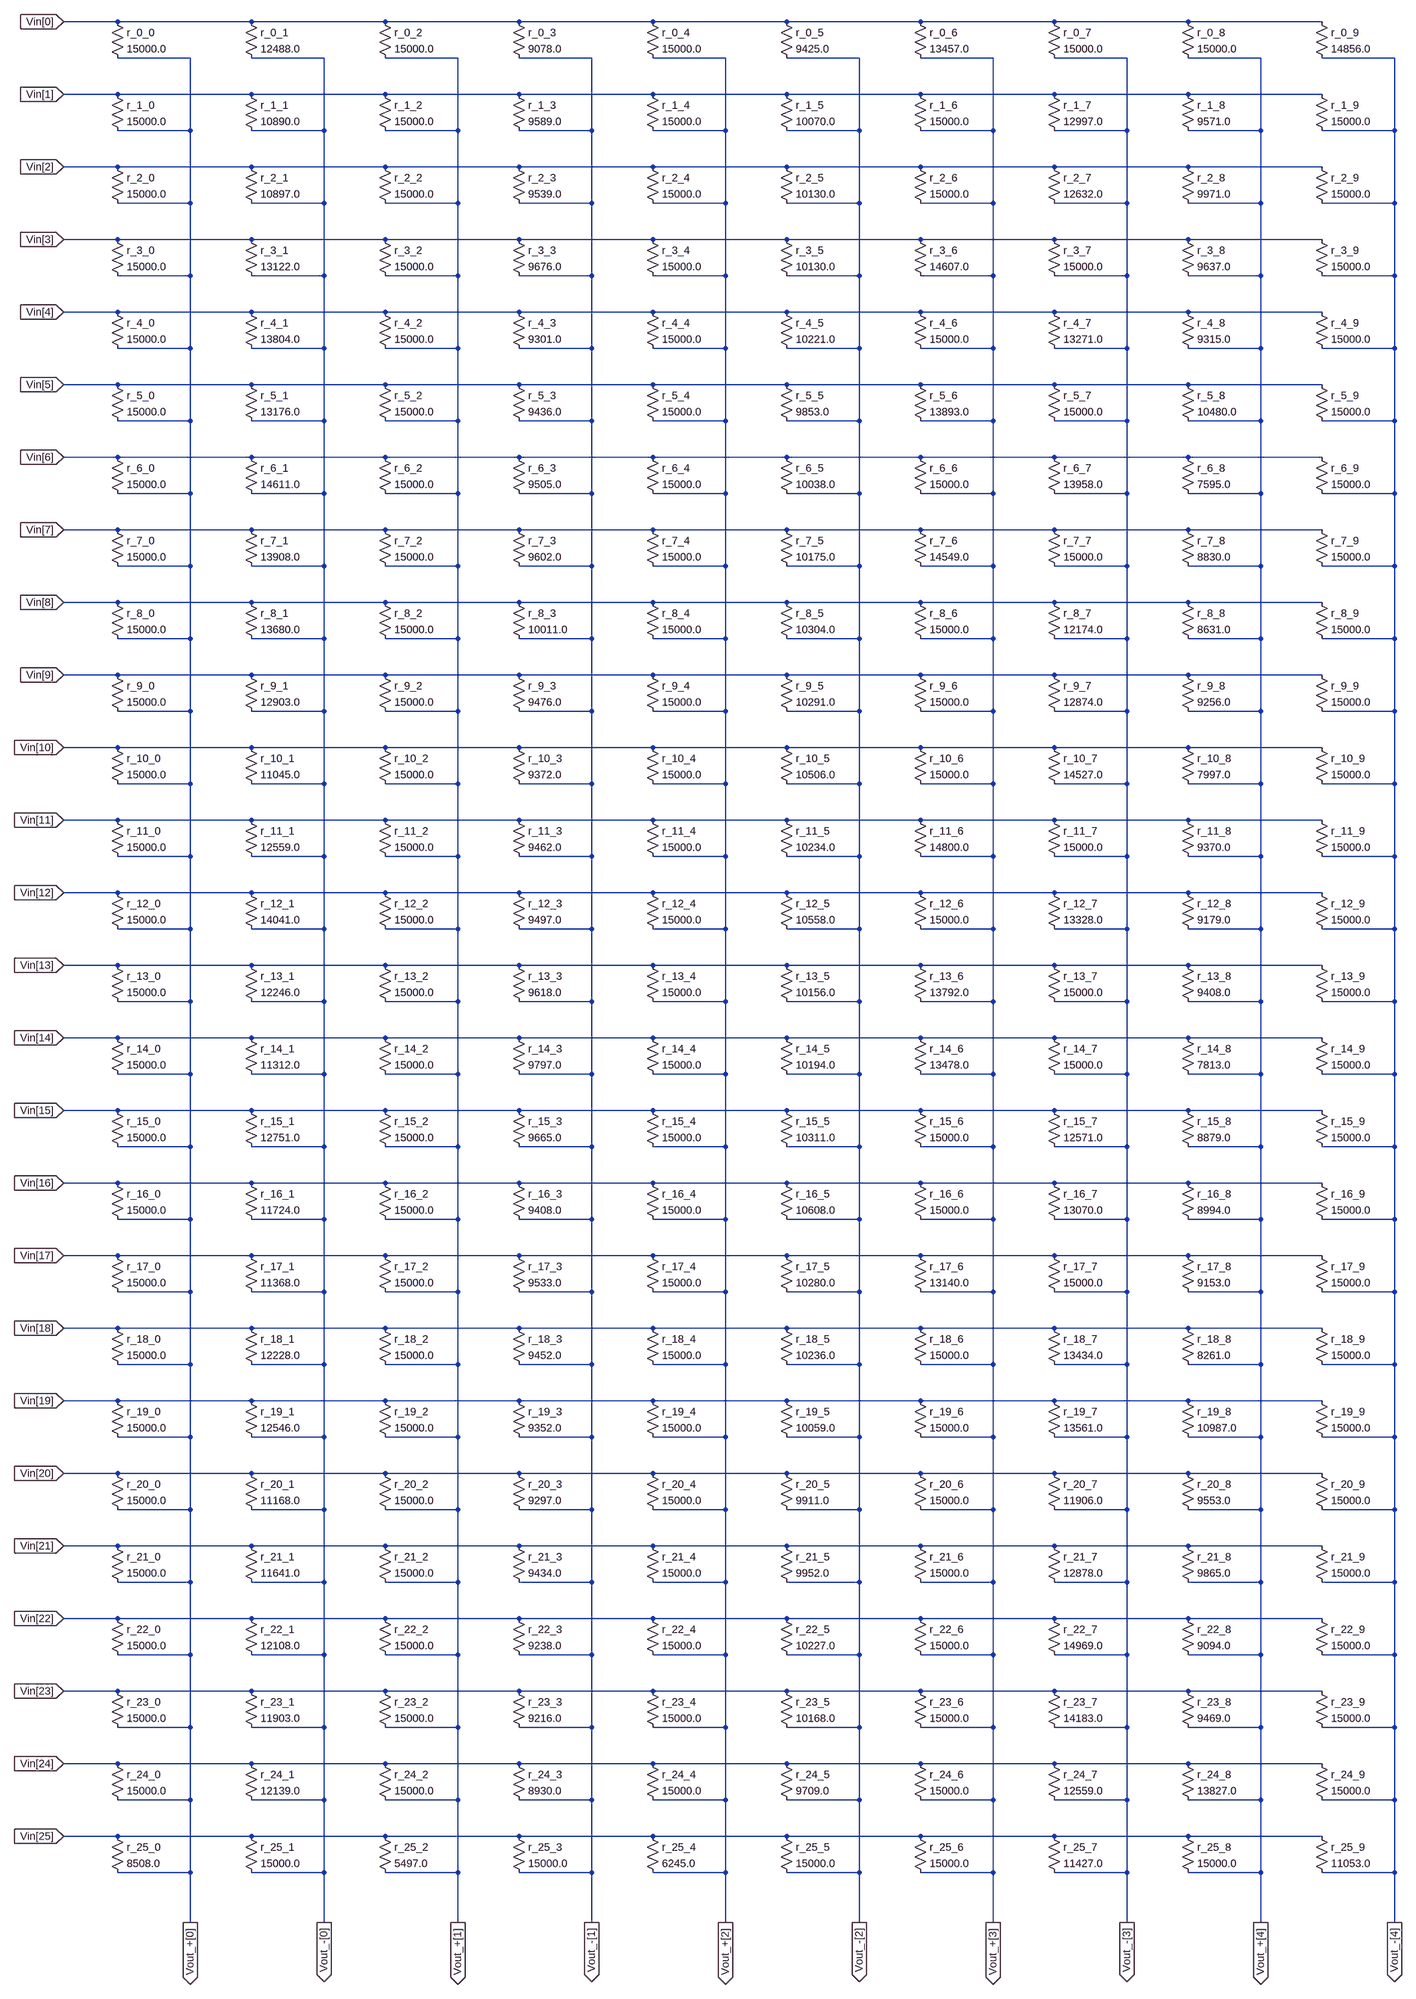
[diagram p0: schematic X_cbar_26by10.asc]
X_cbar_26by10.asc, the LTspice schematic file:
Version 4 
SHEET 1 2360 680
WIRE -160 16 4176 16
WIRE -160 176 4176 176
WIRE -160 336 4176 336
WIRE -160 496 4176 496
WIRE -160 656 4176 656
WIRE -160 816 4176 816
WIRE -160 976 4176 976
WIRE -160 1136 4176 1136
WIRE -160 1296 4176 1296
WIRE -160 1456 4176 1456
WIRE -160 1616 4176 1616
WIRE -160 1776 4176 1776
WIRE -160 1936 4176 1936
WIRE -160 2096 4176 2096
WIRE -160 2256 4176 2256
WIRE -160 2416 4176 2416
WIRE -160 2576 4176 2576
WIRE -160 2736 4176 2736
WIRE -160 2896 4176 2896
WIRE -160 3056 4176 3056
WIRE -160 3216 4176 3216
WIRE -160 3376 4176 3376
WIRE -160 3536 4176 3536
WIRE -160 3696 4176 3696
WIRE -160 3856 4176 3856
WIRE -160 4016 4176 4016
WIRE 16 96 176 96
WIRE 176 96 176 256
WIRE 336 96 496 96
WIRE 496 96 496 256
WIRE 976 96 1136 96
WIRE 1136 96 1136 256
WIRE 1296 96 1456 96
WIRE 1456 96 1456 256
WIRE 1936 96 2096 96
WIRE 2096 96 2096 256
WIRE 2256 96 2416 96
WIRE 2416 96 2416 256
WIRE 2896 96 3056 96
WIRE 3056 96 3056 256
WIRE 3216 96 3376 96
WIRE 3376 96 3376 256
WIRE 3856 96 4016 96
WIRE 4016 96 4016 256
WIRE 4176 96 4336 96
WIRE 4336 96 4336 256
WIRE 16 256 176 256
WIRE 176 256 176 416
WIRE 336 256 496 256
WIRE 496 256 496 416
WIRE 976 256 1136 256
WIRE 1136 256 1136 416
WIRE 1296 256 1456 256
WIRE 1456 256 1456 416
WIRE 1936 256 2096 256
WIRE 2096 256 2096 416
WIRE 2256 256 2416 256
WIRE 2416 256 2416 416
WIRE 2896 256 3056 256
WIRE 3056 256 3056 416
WIRE 3216 256 3376 256
WIRE 3376 256 3376 416
WIRE 3856 256 4016 256
WIRE 4016 256 4016 416
WIRE 4176 256 4336 256
WIRE 4336 256 4336 416
WIRE 16 416 176 416
WIRE 176 416 176 576
WIRE 336 416 496 416
WIRE 496 416 496 576
WIRE 976 416 1136 416
WIRE 1136 416 1136 576
WIRE 1296 416 1456 416
WIRE 1456 416 1456 576
WIRE 1936 416 2096 416
WIRE 2096 416 2096 576
WIRE 2256 416 2416 416
WIRE 2416 416 2416 576
WIRE 2896 416 3056 416
WIRE 3056 416 3056 576
WIRE 3216 416 3376 416
WIRE 3376 416 3376 576
WIRE 3856 416 4016 416
WIRE 4016 416 4016 576
WIRE 4176 416 4336 416
WIRE 4336 416 4336 576
WIRE 16 576 176 576
WIRE 176 576 176 736
WIRE 336 576 496 576
WIRE 496 576 496 736
WIRE 976 576 1136 576
WIRE 1136 576 1136 736
WIRE 1296 576 1456 576
WIRE 1456 576 1456 736
WIRE 1936 576 2096 576
WIRE 2096 576 2096 736
WIRE 2256 576 2416 576
WIRE 2416 576 2416 736
WIRE 2896 576 3056 576
WIRE 3056 576 3056 736
WIRE 3216 576 3376 576
WIRE 3376 576 3376 736
WIRE 3856 576 4016 576
WIRE 4016 576 4016 736
WIRE 4176 576 4336 576
WIRE 4336 576 4336 736
WIRE 16 736 176 736
WIRE 176 736 176 896
WIRE 336 736 496 736
WIRE 496 736 496 896
WIRE 976 736 1136 736
WIRE 1136 736 1136 896
WIRE 1296 736 1456 736
WIRE 1456 736 1456 896
WIRE 1936 736 2096 736
WIRE 2096 736 2096 896
WIRE 2256 736 2416 736
WIRE 2416 736 2416 896
WIRE 2896 736 3056 736
WIRE 3056 736 3056 896
WIRE 3216 736 3376 736
WIRE 3376 736 3376 896
WIRE 3856 736 4016 736
WIRE 4016 736 4016 896
WIRE 4176 736 4336 736
WIRE 4336 736 4336 896
WIRE 16 896 176 896
WIRE 176 896 176 1056
WIRE 336 896 496 896
WIRE 496 896 496 1056
WIRE 976 896 1136 896
WIRE 1136 896 1136 1056
WIRE 1296 896 1456 896
WIRE 1456 896 1456 1056
WIRE 1936 896 2096 896
WIRE 2096 896 2096 1056
WIRE 2256 896 2416 896
WIRE 2416 896 2416 1056
WIRE 2896 896 3056 896
WIRE 3056 896 3056 1056
WIRE 3216 896 3376 896
WIRE 3376 896 3376 1056
WIRE 3856 896 4016 896
WIRE 4016 896 4016 1056
WIRE 4176 896 4336 896
WIRE 4336 896 4336 1056
WIRE 16 1056 176 1056
WIRE 176 1056 176 1216
WIRE 336 1056 496 1056
WIRE 496 1056 496 1216
WIRE 976 1056 1136 1056
WIRE 1136 1056 1136 1216
WIRE 1296 1056 1456 1056
WIRE 1456 1056 1456 1216
WIRE 1936 1056 2096 1056
WIRE 2096 1056 2096 1216
WIRE 2256 1056 2416 1056
WIRE 2416 1056 2416 1216
WIRE 2896 1056 3056 1056
WIRE 3056 1056 3056 1216
WIRE 3216 1056 3376 1056
WIRE 3376 1056 3376 1216
WIRE 3856 1056 4016 1056
WIRE 4016 1056 4016 1216
WIRE 4176 1056 4336 1056
WIRE 4336 1056 4336 1216
WIRE 16 1216 176 1216
WIRE 176 1216 176 1376
WIRE 336 1216 496 1216
WIRE 496 1216 496 1376
WIRE 976 1216 1136 1216
WIRE 1136 1216 1136 1376
WIRE 1296 1216 1456 1216
WIRE 1456 1216 1456 1376
WIRE 1936 1216 2096 1216
WIRE 2096 1216 2096 1376
WIRE 2256 1216 2416 1216
WIRE 2416 1216 2416 1376
WIRE 2896 1216 3056 1216
WIRE 3056 1216 3056 1376
WIRE 3216 1216 3376 1216
WIRE 3376 1216 3376 1376
WIRE 3856 1216 4016 1216
WIRE 4016 1216 4016 1376
WIRE 4176 1216 4336 1216
WIRE 4336 1216 4336 1376
WIRE 16 1376 176 1376
WIRE 176 1376 176 1536
WIRE 336 1376 496 1376
WIRE 496 1376 496 1536
WIRE 976 1376 1136 1376
WIRE 1136 1376 1136 1536
WIRE 1296 1376 1456 1376
WIRE 1456 1376 1456 1536
WIRE 1936 1376 2096 1376
WIRE 2096 1376 2096 1536
WIRE 2256 1376 2416 1376
WIRE 2416 1376 2416 1536
WIRE 2896 1376 3056 1376
WIRE 3056 1376 3056 1536
WIRE 3216 1376 3376 1376
WIRE 3376 1376 3376 1536
WIRE 3856 1376 4016 1376
WIRE 4016 1376 4016 1536
WIRE 4176 1376 4336 1376
WIRE 4336 1376 4336 1536
WIRE 16 1536 176 1536
WIRE 176 1536 176 1696
WIRE 336 1536 496 1536
WIRE 496 1536 496 1696
WIRE 976 1536 1136 1536
WIRE 1136 1536 1136 1696
WIRE 1296 1536 1456 1536
WIRE 1456 1536 1456 1696
WIRE 1936 1536 2096 1536
WIRE 2096 1536 2096 1696
WIRE 2256 1536 2416 1536
WIRE 2416 1536 2416 1696
WIRE 2896 1536 3056 1536
WIRE 3056 1536 3056 1696
WIRE 3216 1536 3376 1536
WIRE 3376 1536 3376 1696
WIRE 3856 1536 4016 1536
WIRE 4016 1536 4016 1696
WIRE 4176 1536 4336 1536
WIRE 4336 1536 4336 1696
WIRE 16 1696 176 1696
WIRE 176 1696 176 1856
WIRE 336 1696 496 1696
WIRE 496 1696 496 1856
WIRE 976 1696 1136 1696
WIRE 1136 1696 1136 1856
WIRE 1296 1696 1456 1696
WIRE 1456 1696 1456 1856
WIRE 1936 1696 2096 1696
WIRE 2096 1696 2096 1856
WIRE 2256 1696 2416 1696
WIRE 2416 1696 2416 1856
WIRE 2896 1696 3056 1696
WIRE 3056 1696 3056 1856
WIRE 3216 1696 3376 1696
WIRE 3376 1696 3376 1856
WIRE 3856 1696 4016 1696
WIRE 4016 1696 4016 1856
WIRE 4176 1696 4336 1696
WIRE 4336 1696 4336 1856
WIRE 16 1856 176 1856
WIRE 176 1856 176 2016
WIRE 336 1856 496 1856
WIRE 496 1856 496 2016
WIRE 976 1856 1136 1856
WIRE 1136 1856 1136 2016
WIRE 1296 1856 1456 1856
WIRE 1456 1856 1456 2016
WIRE 1936 1856 2096 1856
WIRE 2096 1856 2096 2016
WIRE 2256 1856 2416 1856
WIRE 2416 1856 2416 2016
WIRE 2896 1856 3056 1856
WIRE 3056 1856 3056 2016
WIRE 3216 1856 3376 1856
WIRE 3376 1856 3376 2016
WIRE 3856 1856 4016 1856
WIRE 4016 1856 4016 2016
WIRE 4176 1856 4336 1856
WIRE 4336 1856 4336 2016
WIRE 16 2016 176 2016
WIRE 176 2016 176 2176
WIRE 336 2016 496 2016
WIRE 496 2016 496 2176
WIRE 976 2016 1136 2016
WIRE 1136 2016 1136 2176
WIRE 1296 2016 1456 2016
WIRE 1456 2016 1456 2176
WIRE 1936 2016 2096 2016
WIRE 2096 2016 2096 2176
WIRE 2256 2016 2416 2016
WIRE 2416 2016 2416 2176
WIRE 2896 2016 3056 2016
WIRE 3056 2016 3056 2176
WIRE 3216 2016 3376 2016
WIRE 3376 2016 3376 2176
WIRE 3856 2016 4016 2016
WIRE 4016 2016 4016 2176
WIRE 4176 2016 4336 2016
WIRE 4336 2016 4336 2176
WIRE 16 2176 176 2176
WIRE 176 2176 176 2336
WIRE 336 2176 496 2176
WIRE 496 2176 496 2336
WIRE 976 2176 1136 2176
WIRE 1136 2176 1136 2336
WIRE 1296 2176 1456 2176
WIRE 1456 2176 1456 2336
WIRE 1936 2176 2096 2176
WIRE 2096 2176 2096 2336
WIRE 2256 2176 2416 2176
WIRE 2416 2176 2416 2336
WIRE 2896 2176 3056 2176
WIRE 3056 2176 3056 2336
WIRE 3216 2176 3376 2176
WIRE 3376 2176 3376 2336
WIRE 3856 2176 4016 2176
WIRE 4016 2176 4016 2336
WIRE 4176 2176 4336 2176
WIRE 4336 2176 4336 2336
WIRE 16 2336 176 2336
WIRE 176 2336 176 2496
WIRE 336 2336 496 2336
WIRE 496 2336 496 2496
WIRE 976 2336 1136 2336
WIRE 1136 2336 1136 2496
WIRE 1296 2336 1456 2336
WIRE 1456 2336 1456 2496
WIRE 1936 2336 2096 2336
WIRE 2096 2336 2096 2496
WIRE 2256 2336 2416 2336
WIRE 2416 2336 2416 2496
WIRE 2896 2336 3056 2336
WIRE 3056 2336 3056 2496
WIRE 3216 2336 3376 2336
WIRE 3376 2336 3376 2496
WIRE 3856 2336 4016 2336
WIRE 4016 2336 4016 2496
WIRE 4176 2336 4336 2336
WIRE 4336 2336 4336 2496
WIRE 16 2496 176 2496
WIRE 176 2496 176 2656
WIRE 336 2496 496 2496
WIRE 496 2496 496 2656
WIRE 976 2496 1136 2496
WIRE 1136 2496 1136 2656
WIRE 1296 2496 1456 2496
WIRE 1456 2496 1456 2656
WIRE 1936 2496 2096 2496
WIRE 2096 2496 2096 2656
WIRE 2256 2496 2416 2496
WIRE 2416 2496 2416 2656
WIRE 2896 2496 3056 2496
WIRE 3056 2496 3056 2656
WIRE 3216 2496 3376 2496
WIRE 3376 2496 3376 2656
WIRE 3856 2496 4016 2496
WIRE 4016 2496 4016 2656
WIRE 4176 2496 4336 2496
WIRE 4336 2496 4336 2656
WIRE 16 2656 176 2656
WIRE 176 2656 176 2816
WIRE 336 2656 496 2656
WIRE 496 2656 496 2816
WIRE 976 2656 1136 2656
WIRE 1136 2656 1136 2816
WIRE 1296 2656 1456 2656
WIRE 1456 2656 1456 2816
WIRE 1936 2656 2096 2656
WIRE 2096 2656 2096 2816
WIRE 2256 2656 2416 2656
WIRE 2416 2656 2416 2816
WIRE 2896 2656 3056 2656
WIRE 3056 2656 3056 2816
WIRE 3216 2656 3376 2656
WIRE 3376 2656 3376 2816
WIRE 3856 2656 4016 2656
WIRE 4016 2656 4016 2816
WIRE 4176 2656 4336 2656
WIRE 4336 2656 4336 2816
WIRE 16 2816 176 2816
WIRE 176 2816 176 2976
WIRE 336 2816 496 2816
WIRE 496 2816 496 2976
WIRE 976 2816 1136 2816
WIRE 1136 2816 1136 2976
WIRE 1296 2816 1456 2816
WIRE 1456 2816 1456 2976
WIRE 1936 2816 2096 2816
WIRE 2096 2816 2096 2976
WIRE 2256 2816 2416 2816
WIRE 2416 2816 2416 2976
WIRE 2896 2816 3056 2816
WIRE 3056 2816 3056 2976
WIRE 3216 2816 3376 2816
WIRE 3376 2816 3376 2976
WIRE 3856 2816 4016 2816
WIRE 4016 2816 4016 2976
WIRE 4176 2816 4336 2816
WIRE 4336 2816 4336 2976
WIRE 16 2976 176 2976
WIRE 176 2976 176 3136
WIRE 336 2976 496 2976
WIRE 496 2976 496 3136
WIRE 976 2976 1136 2976
WIRE 1136 2976 1136 3136
WIRE 1296 2976 1456 2976
WIRE 1456 2976 1456 3136
WIRE 1936 2976 2096 2976
WIRE 2096 2976 2096 3136
WIRE 2256 2976 2416 2976
WIRE 2416 2976 2416 3136
WIRE 2896 2976 3056 2976
WIRE 3056 2976 3056 3136
WIRE 3216 2976 3376 2976
WIRE 3376 2976 3376 3136
WIRE 3856 2976 4016 2976
WIRE 4016 2976 4016 3136
WIRE 4176 2976 4336 2976
WIRE 4336 2976 4336 3136
WIRE 16 3136 176 3136
WIRE 176 3136 176 3296
WIRE 336 3136 496 3136
WIRE 496 3136 496 3296
WIRE 976 3136 1136 3136
WIRE 1136 3136 1136 3296
WIRE 1296 3136 1456 3136
WIRE 1456 3136 1456 3296
WIRE 1936 3136 2096 3136
WIRE 2096 3136 2096 3296
WIRE 2256 3136 2416 3136
WIRE 2416 3136 2416 3296
WIRE 2896 3136 3056 3136
WIRE 3056 3136 3056 3296
WIRE 3216 3136 3376 3136
WIRE 3376 3136 3376 3296
WIRE 3856 3136 4016 3136
WIRE 4016 3136 4016 3296
WIRE 4176 3136 4336 3136
WIRE 4336 3136 4336 3296
WIRE 16 3296 176 3296
WIRE 176 3296 176 3456
WIRE 336 3296 496 3296
WIRE 496 3296 496 3456
WIRE 976 3296 1136 3296
WIRE 1136 3296 1136 3456
WIRE 1296 3296 1456 3296
WIRE 1456 3296 1456 3456
WIRE 1936 3296 2096 3296
WIRE 2096 3296 2096 3456
WIRE 2256 3296 2416 3296
WIRE 2416 3296 2416 3456
WIRE 2896 3296 3056 3296
WIRE 3056 3296 3056 3456
WIRE 3216 3296 3376 3296
WIRE 3376 3296 3376 3456
WIRE 3856 3296 4016 3296
WIRE 4016 3296 4016 3456
WIRE 4176 3296 4336 3296
WIRE 4336 3296 4336 3456
WIRE 16 3456 176 3456
WIRE 176 3456 176 3616
WIRE 336 3456 496 3456
WIRE 496 3456 496 3616
WIRE 976 3456 1136 3456
WIRE 1136 3456 1136 3616
WIRE 1296 3456 1456 3456
WIRE 1456 3456 1456 3616
WIRE 1936 3456 2096 3456
WIRE 2096 3456 2096 3616
WIRE 2256 3456 2416 3456
WIRE 2416 3456 2416 3616
WIRE 2896 3456 3056 3456
WIRE 3056 3456 3056 3616
WIRE 3216 3456 3376 3456
WIRE 3376 3456 3376 3616
WIRE 3856 3456 4016 3456
WIRE 4016 3456 4016 3616
WIRE 4176 3456 4336 3456
WIRE 4336 3456 4336 3616
WIRE 16 3616 176 3616
WIRE 176 3616 176 3776
WIRE 336 3616 496 3616
WIRE 496 3616 496 3776
WIRE 976 3616 1136 3616
WIRE 1136 3616 1136 3776
WIRE 1296 3616 1456 3616
WIRE 1456 3616 1456 3776
WIRE 1936 3616 2096 3616
WIRE 2096 3616 2096 3776
WIRE 2256 3616 2416 3616
WIRE 2416 3616 2416 3776
WIRE 2896 3616 3056 3616
WIRE 3056 3616 3056 3776
WIRE 3216 3616 3376 3616
WIRE 3376 3616 3376 3776
WIRE 3856 3616 4016 3616
WIRE 4016 3616 4016 3776
WIRE 4176 3616 4336 3616
WIRE 4336 3616 4336 3776
WIRE 16 3776 176 3776
WIRE 176 3776 176 3936
WIRE 336 3776 496 3776
WIRE 496 3776 496 3936
WIRE 976 3776 1136 3776
WIRE 1136 3776 1136 3936
WIRE 1296 3776 1456 3776
WIRE 1456 3776 1456 3936
WIRE 1936 3776 2096 3776
WIRE 2096 3776 2096 3936
WIRE 2256 3776 2416 3776
WIRE 2416 3776 2416 3936
WIRE 2896 3776 3056 3776
WIRE 3056 3776 3056 3936
WIRE 3216 3776 3376 3776
WIRE 3376 3776 3376 3936
WIRE 3856 3776 4016 3776
WIRE 4016 3776 4016 3936
WIRE 4176 3776 4336 3776
WIRE 4336 3776 4336 3936
WIRE 16 3936 176 3936
WIRE 176 3936 176 4096
WIRE 336 3936 496 3936
WIRE 496 3936 496 4096
WIRE 976 3936 1136 3936
WIRE 1136 3936 1136 4096
WIRE 1296 3936 1456 3936
WIRE 1456 3936 1456 4096
WIRE 1936 3936 2096 3936
WIRE 2096 3936 2096 4096
WIRE 2256 3936 2416 3936
WIRE 2416 3936 2416 4096
WIRE 2896 3936 3056 3936
WIRE 3056 3936 3056 4096
WIRE 3216 3936 3376 3936
WIRE 3376 3936 3376 4096
WIRE 3856 3936 4016 3936
WIRE 4016 3936 4016 4096
WIRE 4176 3936 4336 3936
WIRE 4336 3936 4336 4096
WIRE 16 4096 176 4096
WIRE 176 4096 176 4256
WIRE 336 4096 496 4096
WIRE 496 4096 496 4256
WIRE 976 4096 1136 4096
WIRE 1136 4096 1136 4256
WIRE 1296 4096 1456 4096
WIRE 1456 4096 1456 4256
WIRE 1936 4096 2096 4096
WIRE 2096 4096 2096 4256
WIRE 2256 4096 2416 4096
WIRE 2416 4096 2416 4256
WIRE 2896 4096 3056 4096
WIRE 3056 4096 3056 4256
WIRE 3216 4096 3376 4096
WIRE 3376 4096 3376 4256
WIRE 3856 4096 4016 4096
WIRE 4016 4096 4016 4256
WIRE 4176 4096 4336 4096
WIRE 4336 4096 4336 4256
FLAG -160 16 Vin[0]
IOPIN -160 16 In
FLAG -160 176 Vin[1]
IOPIN -160 176 In
FLAG -160 336 Vin[2]
IOPIN -160 336 In
FLAG -160 496 Vin[3]
IOPIN -160 496 In
FLAG -160 656 Vin[4]
IOPIN -160 656 In
FLAG -160 816 Vin[5]
IOPIN -160 816 In
FLAG -160 976 Vin[6]
IOPIN -160 976 In
FLAG -160 1136 Vin[7]
IOPIN -160 1136 In
FLAG -160 1296 Vin[8]
IOPIN -160 1296 In
FLAG -160 1456 Vin[9]
IOPIN -160 1456 In
FLAG -160 1616 Vin[10]
IOPIN -160 1616 In
FLAG -160 1776 Vin[11]
IOPIN -160 1776 In
FLAG -160 1936 Vin[12]
IOPIN -160 1936 In
FLAG -160 2096 Vin[13]
IOPIN -160 2096 In
FLAG -160 2256 Vin[14]
IOPIN -160 2256 In
FLAG -160 2416 Vin[15]
IOPIN -160 2416 In
FLAG -160 2576 Vin[16]
IOPIN -160 2576 In
FLAG -160 2736 Vin[17]
IOPIN -160 2736 In
FLAG -160 2896 Vin[18]
IOPIN -160 2896 In
FLAG -160 3056 Vin[19]
IOPIN -160 3056 In
FLAG -160 3216 Vin[20]
IOPIN -160 3216 In
FLAG -160 3376 Vin[21]
IOPIN -160 3376 In
FLAG -160 3536 Vin[22]
IOPIN -160 3536 In
FLAG -160 3696 Vin[23]
IOPIN -160 3696 In
FLAG -160 3856 Vin[24]
IOPIN -160 3856 In
FLAG -160 4016 Vin[25]
IOPIN -160 4016 In
FLAG 176 4256 Vout_+[0]
IOPIN 176 4256 Out
FLAG 496 4256 Vout_-[0]
IOPIN 496 4256 Out
FLAG 1136 4256 Vout_+[1]
IOPIN 1136 4256 Out
FLAG 1456 4256 Vout_-[1]
IOPIN 1456 4256 Out
FLAG 2096 4256 Vout_+[2]
IOPIN 2096 4256 Out
FLAG 2416 4256 Vout_-[2]
IOPIN 2416 4256 Out
FLAG 3056 4256 Vout_+[3]
IOPIN 3056 4256 Out
FLAG 3376 4256 Vout_-[3]
IOPIN 3376 4256 Out
FLAG 4016 4256 Vout_+[4]
IOPIN 4016 4256 Out
FLAG 4336 4256 Vout_-[4]
IOPIN 4336 4256 Out
SYMBOL res 0 0 R0
SYMATTR InstName r_0_0
SYMATTR Value 15000.0
SYMBOL res 320 0 R0
SYMATTR InstName r_0_1
SYMATTR Value 12488.0
SYMBOL res 960 0 R0
SYMATTR InstName r_0_2
SYMATTR Value 15000.0
SYMBOL res 1280 0 R0
SYMATTR InstName r_0_3
SYMATTR Value 9078.0
SYMBOL res 1920 0 R0
SYMATTR InstName r_0_4
SYMATTR Value 15000.0
SYMBOL res 2240 0 R0
SYMATTR InstName r_0_5
SYMATTR Value 9425.0
SYMBOL res 2880 0 R0
SYMATTR InstName r_0_6
SYMATTR Value 13457.0
SYMBOL res 3200 0 R0
SYMATTR InstName r_0_7
SYMATTR Value 15000.0
SYMBOL res 3840 0 R0
SYMATTR InstName r_0_8
SYMATTR Value 15000.0
SYMBOL res 4160 0 R0
SYMATTR InstName r_0_9
SYMATTR Value 14856.0
SYMBOL res 0 160 R0
SYMATTR InstName r_1_0
SYMATTR Value 15000.0
SYMBOL res 320 160 R0
SYMATTR InstName r_1_1
SYMATTR Value 10890.0
SYMBOL res 960 160 R0
SYMATTR InstName r_1_2
SYMATTR Value 15000.0
SYMBOL res 1280 160 R0
SYMATTR InstName r_1_3
SYMATTR Value 9589.0
SYMBOL res 1920 160 R0
SYMATTR InstName r_1_4
SYMATTR Value 15000.0
SYMBOL res 2240 160 R0
SYMATTR InstName r_1_5
SYMATTR Value 10070.0
SYMBOL res 2880 160 R0
SYMATTR InstName r_1_6
SYMATTR Value 15000.0
SYMBOL res 3200 160 R0
SYMATTR InstName r_1_7
SYMATTR Value 12997.0
SYMBOL res 3840 160 R0
SYMATTR InstName r_1_8
SYMATTR Value 9571.0
SYMBOL res 4160 160 R0
SYMATTR InstName r_1_9
SYMATTR Value 15000.0
SYMBOL res 0 320 R0
SYMATTR InstName r_2_0
SYMATTR Value 15000.0
SYMBOL res 320 320 R0
SYMATTR InstName r_2_1
SYMATTR Value 10897.0
SYMBOL res 960 320 R0
SYMATTR InstName r_2_2
SYMATTR Value 15000.0
SYMBOL res 1280 320 R0
SYMATTR InstName r_2_3
SYMATTR Value 9539.0
SYMBOL res 1920 320 R0
SYMATTR InstName r_2_4
SYMATTR Value 15000.0
SYMBOL res 2240 320 R0
SYMATTR InstName r_2_5
SYMATTR Value 10130.0
SYMBOL res 2880 320 R0
SYMATTR InstName r_2_6
SYMATTR Value 15000.0
SYMBOL res 3200 320 R0
SYMATTR InstName r_2_7
SYMATTR Value 12632.0
SYMBOL res 3840 320 R0
SYMATTR InstName r_2_8
SYMATTR Value 9971.0
SYMBOL res 4160 320 R0
SYMATTR InstName r_2_9
SYMATTR Value 15000.0
SYMBOL res 0 480 R0
SYMATTR InstName r_3_0
SYMATTR Value 15000.0
SYMBOL res 320 480 R0
SYMATTR InstName r_3_1
SYMATTR Value 13122.0
SYMBOL res 960 480 R0
SYMATTR InstName r_3_2
SYMATTR Value 15000.0
SYMBOL res 1280 480 R0
SYMATTR InstName r_3_3
SYMATTR Value 9676.0
SYMBOL res 1920 480 R0
SYMATTR InstName r_3_4
SYMATTR Value 15000.0
SYMBOL res 2240 480 R0
SYMATTR InstName r_3_5
SYMATTR Value 10130.0
SYMBOL res 2880 480 R0
SYMATTR InstName r_3_6
SYMATTR Value 14607.0
SYMBOL res 3200 480 R0
SYMATTR InstName r_3_7
SYMATTR Value 15000.0
SYMBOL res 3840 480 R0
SYMATTR InstName r_3_8
SYMATTR Value 9637.0
SYMBOL res 4160 480 R0
SYMATTR InstName r_3_9
SYMATTR Value 15000.0
SYMBOL res 0 640 R0
SYMATTR InstName r_4_0
SYMATTR Value 15000.0
SYMBOL res 320 640 R0
SYMATTR InstName r_4_1
SYMATTR Value 13804.0
SYMBOL res 960 640 R0
SYMATTR InstName r_4_2
SYMATTR Value 15000.0
SYMBOL res 1280 640 R0
SYMATTR InstName r_4_3
SYMATTR Value 9301.0
SYMBOL res 1920 640 R0
SYMATTR InstName r_4_4
SYMATTR Value 15000.0
SYMBOL res 2240 640 R0
SYMATTR InstName r_4_5
SYMATTR Value 10221.0
SYMBOL res 2880 640 R0
SYMATTR InstName r_4_6
SYMATTR Value 15000.0
SYMBOL res 3200 640 R0
SYMATTR InstName r_4_7
SYMATTR Value 13271.0
SYMBOL res 3840 640 R0
SYMATTR InstName r_4_8
SYMATTR Value 9315.0
SYMBOL res 4160 640 R0
SYMATTR InstName r_4_9
SYMATTR Value 15000.0
SYMBOL res 0 800 R0
SYMATTR InstName r_5_0
SYMATTR Value 15000.0
SYMBOL res 320 800 R0
SYMATTR InstName r_5_1
SYMATTR Value 13176.0
SYMBOL res 960 800 R0
SYMATTR InstName r_5_2
SYMATTR Value 15000.0
SYMBOL res 1280 800 R0
SYMATTR InstName r_5_3
SYMATTR Value 9436.0
SYMBOL res 1920 800 R0
SYMATTR InstName r_5_4
SYMATTR Value 15000.0
SYMBOL res 2240 800 R0
SYMATTR InstName r_5_5
SYMATTR Value 9853.0
SYMBOL res 2880 800 R0
SYMATTR InstName r_5_6
SYMATTR Value 13893.0
SYMBOL res 3200 800 R0
SYMATTR InstName r_5_7
SYMATTR Value 15000.0
SYMBOL res 3840 800 R0
SYMATTR InstName r_5_8
SYMATTR Value 10480.0
SYMBOL res 4160 800 R0
SYMATTR InstName r_5_9
SYMATTR Value 15000.0
SYMBOL res 0 960 R0
SYMATTR InstName r_6_0
SYMATTR Value 15000.0
SYMBOL res 320 960 R0
SYMATTR InstName r_6_1
SYMATTR Value 14611.0
SYMBOL res 960 960 R0
SYMATTR InstName r_6_2
SYMATTR Value 15000.0
SYMBOL res 1280 960 R0
SYMATTR InstName r_6_3
SYMATTR Value 9505.0
SYMBOL res 1920 960 R0
SYMATTR InstName r_6_4
SYMATTR Value 15000.0
SYMBOL res 2240 960 R0
SYMATTR InstName r_6_5
SYMATTR Value 10038.0
SYMBOL res 2880 960 R0
SYMATTR InstName r_6_6
SYMATTR Value 15000.0
SYMBOL res 3200 960 R0
SYMATTR InstName r_6_7
SYMATTR Value 13958.0
SYMBOL res 3840 960 R0
SYMATTR InstName r_6_8
SYMATTR Value 7595.0
SYMBOL res 4160 960 R0
SYMATTR InstName r_6_9
SYMATTR Value 15000.0
SYMBOL res 0 1120 R0
SYMATTR InstName r_7_0
SYMATTR Value 15000.0
SYMBOL res 320 1120 R0
SYMATTR InstName r_7_1
SYMATTR Value 13908.0
SYMBOL res 960 1120 R0
SYMATTR InstName r_7_2
SYMATTR Value 15000.0
SYMBOL res 1280 1120 R0
SYMATTR InstName r_7_3
SYMATTR Value 9602.0
SYMBOL res 1920 1120 R0
SYMATTR InstName r_7_4
SYMATTR Value 15000.0
SYMBOL res 2240 1120 R0
SYMATTR InstName r_7_5
SYMATTR Value 10175.0
SYMBOL res 2880 1120 R0
SYMATTR InstName r_7_6
SYMATTR Value 14549.0
SYMBOL res 3200 1120 R0
SYMATTR InstName r_7_7
SYMATTR Value 15000.0
SYMBOL res 3840 1120 R0
SYMATTR InstName r_7_8
SYMATTR Value 8830.0
SYMBOL res 4160 1120 R0
SYMATTR InstName r_7_9
SYMATTR Value 15000.0
SYMBOL res 0 1280 R0
SYMATTR InstName r_8_0
SYMATTR Value 15000.0
SYMBOL res 320 1280 R0
SYMATTR InstName r_8_1
SYMATTR Value 13680.0
SYMBOL res 960 1280 R0
SYMATTR InstName r_8_2
SYMATTR Value 15000.0
SYMBOL res 1280 1280 R0
SYMATTR InstName r_8_3
SYMATTR Value 10011.0
SYMBOL res 1920 1280 R0
SYMATTR InstName r_8_4
SYMATTR Value 15000.0
SYMBOL res 2240 1280 R0
SYMATTR InstName r_8_5
SYMATTR Value 10304.0
SYMBOL res 2880 1280 R0
SYMATTR InstName r_8_6
SYMATTR Value 15000.0
SYMBOL res 3200 1280 R0
SYMATTR InstName r_8_7
SYMATTR Value 12174.0
SYMBOL res 3840 1280 R0
SYMATTR InstName r_8_8
SYMATTR Value 8631.0
SYMBOL res 4160 1280 R0
SYMATTR InstName r_8_9
SYMATTR Value 15000.0
SYMBOL res 0 1440 R0
SYMATTR InstName r_9_0
SYMATTR Value 15000.0
SYMBOL res 320 1440 R0
SYMATTR InstName r_9_1
SYMATTR Value 12903.0
SYMBOL res 960 1440 R0
SYMATTR InstName r_9_2
SYMATTR Value 15000.0
SYMBOL res 1280 1440 R0
SYMATTR InstName r_9_3
SYMATTR Value 9476.0
SYMBOL res 1920 1440 R0
SYMATTR InstName r_9_4
SYMATTR Value 15000.0
SYMBOL res 2240 1440 R0
SYMATTR InstName r_9_5
SYMATTR Value 10291.0
SYMBOL res 2880 1440 R0
SYMATTR InstName r_9_6
SYMATTR Value 15000.0
SYMBOL res 3200 1440 R0
SYMATTR InstName r_9_7
SYMATTR Value 12874.0
SYMBOL res 3840 1440 R0
SYMATTR InstName r_9_8
SYMATTR Value 9256.0
SYMBOL res 4160 1440 R0
SYMATTR InstName r_9_9
SYMATTR Value 15000.0
SYMBOL res 0 1600 R0
SYMATTR InstName r_10_0
SYMATTR Value 15000.0
SYMBOL res 320 1600 R0
SYMATTR InstName r_10_1
SYMATTR Value 11045.0
SYMBOL res 960 1600 R0
SYMATTR InstName r_10_2
SYMATTR Value 15000.0
SYMBOL res 1280 1600 R0
SYMATTR InstName r_10_3
SYMATTR Value 9372.0
SYMBOL res 1920 1600 R0
SYMATTR InstName r_10_4
SYMATTR Value 15000.0
SYMBOL res 2240 1600 R0
SYMATTR InstName r_10_5
SYMATTR Value 10506.0
SYMBOL res 2880 1600 R0
SYMATTR InstName r_10_6
SYMATTR Value 15000.0
SYMBOL res 3200 1600 R0
SYMATTR InstName r_10_7
SYMATTR Value 14527.0
SYMBOL res 3840 1600 R0
SYMATTR InstName r_10_8
SYMATTR Value 7997.0
SYMBOL res 4160 1600 R0
SYMATTR InstName r_10_9
SYMATTR Value 15000.0
SYMBOL res 0 1760 R0
SYMATTR InstName r_11_0
SYMATTR Value 15000.0
SYMBOL res 320 1760 R0
SYMATTR InstName r_11_1
SYMATTR Value 12559.0
SYMBOL res 960 1760 R0
SYMATTR InstName r_11_2
SYMATTR Value 15000.0
SYMBOL res 1280 1760 R0
SYMATTR InstName r_11_3
SYMATTR Value 9462.0
SYMBOL res 1920 1760 R0
SYMATTR InstName r_11_4
SYMATTR Value 15000.0
SYMBOL res 2240 1760 R0
SYMATTR InstName r_11_5
SYMATTR Value 10234.0
SYMBOL res 2880 1760 R0
SYMATTR InstName r_11_6
SYMATTR Value 14800.0
SYMBOL res 3200 1760 R0
SYMATTR InstName r_11_7
SYMATTR Value 15000.0
SYMBOL res 3840 1760 R0
SYMATTR InstName r_11_8
SYMATTR Value 9370.0
SYMBOL res 4160 1760 R0
SYMATTR InstName r_11_9
SYMATTR Value 15000.0
SYMBOL res 0 1920 R0
SYMATTR InstName r_12_0
SYMATTR Value 15000.0
SYMBOL res 320 1920 R0
SYMATTR InstName r_12_1
SYMATTR Value 14041.0
SYMBOL res 960 1920 R0
SYMATTR InstName r_12_2
SYMATTR Value 15000.0
SYMBOL res 1280 1920 R0
SYMATTR InstName r_12_3
SYMATTR Value 9497.0
SYMBOL res 1920 1920 R0
SYMATTR InstName r_12_4
SYMATTR Value 15000.0
SYMBOL res 2240 1920 R0
SYMATTR InstName r_12_5
SYMATTR Value 10558.0
SYMBOL res 2880 1920 R0
SYMATTR InstName r_12_6
SYMATTR Value 15000.0
SYMBOL res 3200 1920 R0
SYMATTR InstName r_12_7
SYMATTR Value 13328.0
SYMBOL res 3840 1920 R0
SYMATTR InstName r_12_8
SYMATTR Value 9179.0
SYMBOL res 4160 1920 R0
SYMATTR InstName r_12_9
SYMATTR Value 15000.0
SYMBOL res 0 2080 R0
SYMATTR InstName r_13_0
SYMATTR Value 15000.0
SYMBOL res 320 2080 R0
SYMATTR InstName r_13_1
SYMATTR Value 12246.0
SYMBOL res 960 2080 R0
SYMATTR InstName r_13_2
SYMATTR Value 15000.0
SYMBOL res 1280 2080 R0
SYMATTR InstName r_13_3
SYMATTR Value 9618.0
SYMBOL res 1920 2080 R0
SYMATTR InstName r_13_4
SYMATTR Value 15000.0
SYMBOL res 2240 2080 R0
SYMATTR InstName r_13_5
SYMATTR Value 10156.0
SYMBOL res 2880 2080 R0
SYMATTR InstName r_13_6
SYMATTR Value 13792.0
SYMBOL res 3200 2080 R0
SYMATTR InstName r_13_7
SYMATTR Value 15000.0
SYMBOL res 3840 2080 R0
SYMATTR InstName r_13_8
SYMATTR Value 9408.0
SYMBOL res 4160 2080 R0
SYMATTR InstName r_13_9
SYMATTR Value 15000.0
SYMBOL res 0 2240 R0
SYMATTR InstName r_14_0
SYMATTR Value 15000.0
SYMBOL res 320 2240 R0
SYMATTR InstName r_14_1
SYMATTR Value 11312.0
SYMBOL res 960 2240 R0
SYMATTR InstName r_14_2
SYMATTR Value 15000.0
SYMBOL res 1280 2240 R0
SYMATTR InstName r_14_3
SYMATTR Value 9797.0
SYMBOL res 1920 2240 R0
SYMATTR InstName r_14_4
SYMATTR Value 15000.0
SYMBOL res 2240 2240 R0
SYMATTR InstName r_14_5
SYMATTR Value 10194.0
SYMBOL res 2880 2240 R0
SYMATTR InstName r_14_6
SYMATTR Value 13478.0
SYMBOL res 3200 2240 R0
SYMATTR InstName r_14_7
SYMATTR Value 15000.0
SYMBOL res 3840 2240 R0
SYMATTR InstName r_14_8
SYMATTR Value 7813.0
SYMBOL res 4160 2240 R0
SYMATTR InstName r_14_9
SYMATTR Value 15000.0
SYMBOL res 0 2400 R0
SYMATTR InstName r_15_0
SYMATTR Value 15000.0
SYMBOL res 320 2400 R0
SYMATTR InstName r_15_1
SYMATTR Value 12751.0
SYMBOL res 960 2400 R0
SYMATTR InstName r_15_2
SYMATTR Value 15000.0
SYMBOL res 1280 2400 R0
SYMATTR InstName r_15_3
SYMATTR Value 9665.0
SYMBOL res 1920 2400 R0
SYMATTR InstName r_15_4
SYMATTR Value 15000.0
SYMBOL res 2240 2400 R0
SYMATTR InstName r_15_5
SYMATTR Value 10311.0
SYMBOL res 2880 2400 R0
SYMATTR InstName r_15_6
SYMATTR Value 15000.0
SYMBOL res 3200 2400 R0
SYMATTR InstName r_15_7
SYMATTR Value 12571.0
SYMBOL res 3840 2400 R0
SYMATTR InstName r_15_8
SYMATTR Value 8879.0
SYMBOL res 4160 2400 R0
SYMATTR InstName r_15_9
SYMATTR Value 15000.0
SYMBOL res 0 2560 R0
SYMATTR InstName r_16_0
SYMATTR Value 15000.0
SYMBOL res 320 2560 R0
SYMATTR InstName r_16_1
SYMATTR Value 11724.0
SYMBOL res 960 2560 R0
SYMATTR InstName r_16_2
SYMATTR Value 15000.0
SYMBOL res 1280 2560 R0
SYMATTR InstName r_16_3
SYMATTR Value 9408.0
SYMBOL res 1920 2560 R0
SYMATTR InstName r_16_4
SYMATTR Value 15000.0
SYMBOL res 2240 2560 R0
SYMATTR InstName r_16_5
SYMATTR Value 10608.0
SYMBOL res 2880 2560 R0
SYMATTR InstName r_16_6
SYMATTR Value 15000.0
SYMBOL res 3200 2560 R0
SYMATTR InstName r_16_7
SYMATTR Value 13070.0
SYMBOL res 3840 2560 R0
SYMATTR InstName r_16_8
SYMATTR Value 8994.0
SYMBOL res 4160 2560 R0
SYMATTR InstName r_16_9
SYMATTR Value 15000.0
SYMBOL res 0 2720 R0
SYMATTR InstName r_17_0
SYMATTR Value 15000.0
SYMBOL res 320 2720 R0
SYMATTR InstName r_17_1
SYMATTR Value 11368.0
SYMBOL res 960 2720 R0
SYMATTR InstName r_17_2
SYMATTR Value 15000.0
SYMBOL res 1280 2720 R0
SYMATTR InstName r_17_3
SYMATTR Value 9533.0
SYMBOL res 1920 2720 R0
SYMATTR InstName r_17_4
SYMATTR Value 15000.0
SYMBOL res 2240 2720 R0
SYMATTR InstName r_17_5
SYMATTR Value 10280.0
SYMBOL res 2880 2720 R0
SYMATTR InstName r_17_6
SYMATTR Value 13140.0
SYMBOL res 3200 2720 R0
SYMATTR InstName r_17_7
SYMATTR Value 15000.0
SYMBOL res 3840 2720 R0
SYMATTR InstName r_17_8
SYMATTR Value 9153.0
SYMBOL res 4160 2720 R0
SYMATTR InstName r_17_9
SYMATTR Value 15000.0
SYMBOL res 0 2880 R0
SYMATTR InstName r_18_0
SYMATTR Value 15000.0
SYMBOL res 320 2880 R0
SYMATTR InstName r_18_1
SYMATTR Value 12228.0
SYMBOL res 960 2880 R0
SYMATTR InstName r_18_2
SYMATTR Value 15000.0
SYMBOL res 1280 2880 R0
SYMATTR InstName r_18_3
SYMATTR Value 9452.0
SYMBOL res 1920 2880 R0
SYMATTR InstName r_18_4
SYMATTR Value 15000.0
SYMBOL res 2240 2880 R0
SYMATTR InstName r_18_5
SYMATTR Value 10236.0
SYMBOL res 2880 2880 R0
SYMATTR InstName r_18_6
SYMATTR Value 15000.0
SYMBOL res 3200 2880 R0
SYMATTR InstName r_18_7
SYMATTR Value 13434.0
SYMBOL res 3840 2880 R0
SYMATTR InstName r_18_8
SYMATTR Value 8261.0
SYMBOL res 4160 2880 R0
SYMATTR InstName r_18_9
SYMATTR Value 15000.0
SYMBOL res 0 3040 R0
SYMATTR InstName r_19_0
SYMATTR Value 15000.0
SYMBOL res 320 3040 R0
SYMATTR InstName r_19_1
SYMATTR Value 12546.0
SYMBOL res 960 3040 R0
SYMATTR InstName r_19_2
SYMATTR Value 15000.0
SYMBOL res 1280 3040 R0
SYMATTR InstName r_19_3
SYMATTR Value 9352.0
SYMBOL res 1920 3040 R0
SYMATTR InstName r_19_4
SYMATTR Value 15000.0
SYMBOL res 2240 3040 R0
SYMATTR InstName r_19_5
SYMATTR Value 10059.0
SYMBOL res 2880 3040 R0
SYMATTR InstName r_19_6
SYMATTR Value 15000.0
SYMBOL res 3200 3040 R0
SYMATTR InstName r_19_7
SYMATTR Value 13561.0
SYMBOL res 3840 3040 R0
SYMATTR InstName r_19_8
SYMATTR Value 10987.0
SYMBOL res 4160 3040 R0
SYMATTR InstName r_19_9
SYMATTR Value 15000.0
SYMBOL res 0 3200 R0
SYMATTR InstName r_20_0
SYMATTR Value 15000.0
SYMBOL res 320 3200 R0
SYMATTR InstName r_20_1
SYMATTR Value 11168.0
SYMBOL res 960 3200 R0
SYMATTR InstName r_20_2
SYMATTR Value 15000.0
SYMBOL res 1280 3200 R0
SYMATTR InstName r_20_3
SYMATTR Value 9297.0
SYMBOL res 1920 3200 R0
SYMATTR InstName r_20_4
SYMATTR Value 15000.0
SYMBOL res 2240 3200 R0
SYMATTR InstName r_20_5
SYMATTR Value 9911.0
SYMBOL res 2880 3200 R0
SYMATTR InstName r_20_6
SYMATTR Value 15000.0
SYMBOL res 3200 3200 R0
SYMATTR InstName r_20_7
SYMATTR Value 11906.0
SYMBOL res 3840 3200 R0
SYMATTR InstName r_20_8
SYMATTR Value 9553.0
SYMBOL res 4160 3200 R0
SYMATTR InstName r_20_9
SYMATTR Value 15000.0
SYMBOL res 0 3360 R0
SYMATTR InstName r_21_0
SYMATTR Value 15000.0
SYMBOL res 320 3360 R0
SYMATTR InstName r_21_1
SYMATTR Value 11641.0
SYMBOL res 960 3360 R0
SYMATTR InstName r_21_2
SYMATTR Value 15000.0
SYMBOL res 1280 3360 R0
SYMATTR InstName r_21_3
SYMATTR Value 9434.0
SYMBOL res 1920 3360 R0
SYMATTR InstName r_21_4
SYMATTR Value 15000.0
SYMBOL res 2240 3360 R0
SYMATTR InstName r_21_5
SYMATTR Value 9952.0
SYMBOL res 2880 3360 R0
SYMATTR InstName r_21_6
SYMATTR Value 15000.0
SYMBOL res 3200 3360 R0
SYMATTR InstName r_21_7
SYMATTR Value 12878.0
SYMBOL res 3840 3360 R0
SYMATTR InstName r_21_8
SYMATTR Value 9865.0
SYMBOL res 4160 3360 R0
SYMATTR InstName r_21_9
SYMATTR Value 15000.0
SYMBOL res 0 3520 R0
SYMATTR InstName r_22_0
SYMATTR Value 15000.0
SYMBOL res 320 3520 R0
SYMATTR InstName r_22_1
SYMATTR Value 12108.0
SYMBOL res 960 3520 R0
SYMATTR InstName r_22_2
SYMATTR Value 15000.0
SYMBOL res 1280 3520 R0
SYMATTR InstName r_22_3
SYMATTR Value 9238.0
SYMBOL res 1920 3520 R0
SYMATTR InstName r_22_4
SYMATTR Value 15000.0
SYMBOL res 2240 3520 R0
SYMATTR InstName r_22_5
SYMATTR Value 10227.0
SYMBOL res 2880 3520 R0
SYMATTR InstName r_22_6
SYMATTR Value 15000.0
SYMBOL res 3200 3520 R0
SYMATTR InstName r_22_7
SYMATTR Value 14969.0
SYMBOL res 3840 3520 R0
SYMATTR InstName r_22_8
SYMATTR Value 9094.0
SYMBOL res 4160 3520 R0
SYMATTR InstName r_22_9
SYMATTR Value 15000.0
SYMBOL res 0 3680 R0
SYMATTR InstName r_23_0
SYMATTR Value 15000.0
SYMBOL res 320 3680 R0
SYMATTR InstName r_23_1
SYMATTR Value 11903.0
SYMBOL res 960 3680 R0
SYMATTR InstName r_23_2
SYMATTR Value 15000.0
SYMBOL res 1280 3680 R0
SYMATTR InstName r_23_3
SYMATTR Value 9216.0
SYMBOL res 1920 3680 R0
SYMATTR InstName r_23_4
SYMATTR Value 15000.0
SYMBOL res 2240 3680 R0
SYMATTR InstName r_23_5
SYMATTR Value 10168.0
SYMBOL res 2880 3680 R0
SYMATTR InstName r_23_6
SYMATTR Value 15000.0
SYMBOL res 3200 3680 R0
SYMATTR InstName r_23_7
SYMATTR Value 14183.0
SYMBOL res 3840 3680 R0
SYMATTR InstName r_23_8
SYMATTR Value 9469.0
SYMBOL res 4160 3680 R0
SYMATTR InstName r_23_9
SYMATTR Value 15000.0
SYMBOL res 0 3840 R0
SYMATTR InstName r_24_0
SYMATTR Value 15000.0
SYMBOL res 320 3840 R0
SYMATTR InstName r_24_1
SYMATTR Value 12139.0
SYMBOL res 960 3840 R0
SYMATTR InstName r_24_2
SYMATTR Value 15000.0
SYMBOL res 1280 3840 R0
SYMATTR InstName r_24_3
SYMATTR Value 8930.0
SYMBOL res 1920 3840 R0
SYMATTR InstName r_24_4
SYMATTR Value 15000.0
SYMBOL res 2240 3840 R0
SYMATTR InstName r_24_5
SYMATTR Value 9709.0
SYMBOL res 2880 3840 R0
SYMATTR InstName r_24_6
SYMATTR Value 15000.0
SYMBOL res 3200 3840 R0
SYMATTR InstName r_24_7
SYMATTR Value 12559.0
SYMBOL res 3840 3840 R0
SYMATTR InstName r_24_8
SYMATTR Value 13827.0
SYMBOL res 4160 3840 R0
SYMATTR InstName r_24_9
SYMATTR Value 15000.0
SYMBOL res 0 4000 R0
SYMATTR InstName r_25_0
SYMATTR Value 8508.0
SYMBOL res 320 4000 R0
SYMATTR InstName r_25_1
SYMATTR Value 15000.0
SYMBOL res 960 4000 R0
SYMATTR InstName r_25_2
SYMATTR Value 5497.0
SYMBOL res 1280 4000 R0
SYMATTR InstName r_25_3
SYMATTR Value 15000.0
SYMBOL res 1920 4000 R0
SYMATTR InstName r_25_4
SYMATTR Value 6245.0
SYMBOL res 2240 4000 R0
SYMATTR InstName r_25_5
SYMATTR Value 15000.0
SYMBOL res 2880 4000 R0
SYMATTR InstName r_25_6
SYMATTR Value 15000.0
SYMBOL res 3200 4000 R0
SYMATTR InstName r_25_7
SYMATTR Value 11427.0
SYMBOL res 3840 4000 R0
SYMATTR InstName r_25_8
SYMATTR Value 15000.0
SYMBOL res 4160 4000 R0
SYMATTR InstName r_25_9
SYMATTR Value 11053.0

The netlist it stands for:
* X_cbar_26by10.asc
r_0_0 Vin[0] Vout_+[0] 15000.0
r_0_1 Vin[0] Vout_-[0] 12488.0
r_0_2 Vin[0] Vout_+[1] 15000.0
r_0_3 Vin[0] Vout_-[1] 9078.0
r_0_4 Vin[0] Vout_+[2] 15000.0
r_0_5 Vin[0] Vout_-[2] 9425.0
r_0_6 Vin[0] Vout_+[3] 13457.0
r_0_7 Vin[0] Vout_-[3] 15000.0
r_0_8 Vin[0] Vout_+[4] 15000.0
r_0_9 Vin[0] Vout_-[4] 14856.0
r_1_0 Vin[1] Vout_+[0] 15000.0
r_1_1 Vin[1] Vout_-[0] 10890.0
r_1_2 Vin[1] Vout_+[1] 15000.0
r_1_3 Vin[1] Vout_-[1] 9589.0
r_1_4 Vin[1] Vout_+[2] 15000.0
r_1_5 Vin[1] Vout_-[2] 10070.0
r_1_6 Vin[1] Vout_+[3] 15000.0
r_1_7 Vin[1] Vout_-[3] 12997.0
r_1_8 Vin[1] Vout_+[4] 9571.0
r_1_9 Vin[1] Vout_-[4] 15000.0
r_2_0 Vin[2] Vout_+[0] 15000.0
r_2_1 Vin[2] Vout_-[0] 10897.0
r_2_2 Vin[2] Vout_+[1] 15000.0
r_2_3 Vin[2] Vout_-[1] 9539.0
r_2_4 Vin[2] Vout_+[2] 15000.0
r_2_5 Vin[2] Vout_-[2] 10130.0
r_2_6 Vin[2] Vout_+[3] 15000.0
r_2_7 Vin[2] Vout_-[3] 12632.0
r_2_8 Vin[2] Vout_+[4] 9971.0
r_2_9 Vin[2] Vout_-[4] 15000.0
r_3_0 Vin[3] Vout_+[0] 15000.0
r_3_1 Vin[3] Vout_-[0] 13122.0
r_3_2 Vin[3] Vout_+[1] 15000.0
r_3_3 Vin[3] Vout_-[1] 9676.0
r_3_4 Vin[3] Vout_+[2] 15000.0
r_3_5 Vin[3] Vout_-[2] 10130.0
r_3_6 Vin[3] Vout_+[3] 14607.0
r_3_7 Vin[3] Vout_-[3] 15000.0
r_3_8 Vin[3] Vout_+[4] 9637.0
r_3_9 Vin[3] Vout_-[4] 15000.0
r_4_0 Vin[4] Vout_+[0] 15000.0
r_4_1 Vin[4] Vout_-[0] 13804.0
r_4_2 Vin[4] Vout_+[1] 15000.0
r_4_3 Vin[4] Vout_-[1] 9301.0
r_4_4 Vin[4] Vout_+[2] 15000.0
r_4_5 Vin[4] Vout_-[2] 10221.0
r_4_6 Vin[4] Vout_+[3] 15000.0
r_4_7 Vin[4] Vout_-[3] 13271.0
r_4_8 Vin[4] Vout_+[4] 9315.0
r_4_9 Vin[4] Vout_-[4] 15000.0
r_5_0 Vin[5] Vout_+[0] 15000.0
r_5_1 Vin[5] Vout_-[0] 13176.0
r_5_2 Vin[5] Vout_+[1] 15000.0
r_5_3 Vin[5] Vout_-[1] 9436.0
r_5_4 Vin[5] Vout_+[2] 15000.0
r_5_5 Vin[5] Vout_-[2] 9853.0
r_5_6 Vin[5] Vout_+[3] 13893.0
r_5_7 Vin[5] Vout_-[3] 15000.0
r_5_8 Vin[5] Vout_+[4] 10480.0
r_5_9 Vin[5] Vout_-[4] 15000.0
r_6_0 Vin[6] Vout_+[0] 15000.0
r_6_1 Vin[6] Vout_-[0] 14611.0
r_6_2 Vin[6] Vout_+[1] 15000.0
r_6_3 Vin[6] Vout_-[1] 9505.0
r_6_4 Vin[6] Vout_+[2] 15000.0
r_6_5 Vin[6] Vout_-[2] 10038.0
r_6_6 Vin[6] Vout_+[3] 15000.0
r_6_7 Vin[6] Vout_-[3] 13958.0
r_6_8 Vin[6] Vout_+[4] 7595.0
r_6_9 Vin[6] Vout_-[4] 15000.0
r_7_0 Vin[7] Vout_+[0] 15000.0
r_7_1 Vin[7] Vout_-[0] 13908.0
r_7_2 Vin[7] Vout_+[1] 15000.0
r_7_3 Vin[7] Vout_-[1] 9602.0
r_7_4 Vin[7] Vout_+[2] 15000.0
r_7_5 Vin[7] Vout_-[2] 10175.0
r_7_6 Vin[7] Vout_+[3] 14549.0
r_7_7 Vin[7] Vout_-[3] 15000.0
r_7_8 Vin[7] Vout_+[4] 8830.0
r_7_9 Vin[7] Vout_-[4] 15000.0
r_8_0 Vin[8] Vout_+[0] 15000.0
r_8_1 Vin[8] Vout_-[0] 13680.0
r_8_2 Vin[8] Vout_+[1] 15000.0
r_8_3 Vin[8] Vout_-[1] 10011.0
r_8_4 Vin[8] Vout_+[2] 15000.0
r_8_5 Vin[8] Vout_-[2] 10304.0
r_8_6 Vin[8] Vout_+[3] 15000.0
r_8_7 Vin[8] Vout_-[3] 12174.0
r_8_8 Vin[8] Vout_+[4] 8631.0
r_8_9 Vin[8] Vout_-[4] 15000.0
r_9_0 Vin[9] Vout_+[0] 15000.0
r_9_1 Vin[9] Vout_-[0] 12903.0
r_9_2 Vin[9] Vout_+[1] 15000.0
r_9_3 Vin[9] Vout_-[1] 9476.0
r_9_4 Vin[9] Vout_+[2] 15000.0
r_9_5 Vin[9] Vout_-[2] 10291.0
r_9_6 Vin[9] Vout_+[3] 15000.0
r_9_7 Vin[9] Vout_-[3] 12874.0
r_9_8 Vin[9] Vout_+[4] 9256.0
r_9_9 Vin[9] Vout_-[4] 15000.0
r_10_0 Vin[10] Vout_+[0] 15000.0
r_10_1 Vin[10] Vout_-[0] 11045.0
r_10_2 Vin[10] Vout_+[1] 15000.0
r_10_3 Vin[10] Vout_-[1] 9372.0
r_10_4 Vin[10] Vout_+[2] 15000.0
r_10_5 Vin[10] Vout_-[2] 10506.0
r_10_6 Vin[10] Vout_+[3] 15000.0
r_10_7 Vin[10] Vout_-[3] 14527.0
r_10_8 Vin[10] Vout_+[4] 7997.0
r_10_9 Vin[10] Vout_-[4] 15000.0
r_11_0 Vin[11] Vout_+[0] 15000.0
r_11_1 Vin[11] Vout_-[0] 12559.0
r_11_2 Vin[11] Vout_+[1] 15000.0
r_11_3 Vin[11] Vout_-[1] 9462.0
r_11_4 Vin[11] Vout_+[2] 15000.0
r_11_5 Vin[11] Vout_-[2] 10234.0
r_11_6 Vin[11] Vout_+[3] 14800.0
r_11_7 Vin[11] Vout_-[3] 15000.0
r_11_8 Vin[11] Vout_+[4] 9370.0
r_11_9 Vin[11] Vout_-[4] 15000.0
r_12_0 Vin[12] Vout_+[0] 15000.0
r_12_1 Vin[12] Vout_-[0] 14041.0
r_12_2 Vin[12] Vout_+[1] 15000.0
r_12_3 Vin[12] Vout_-[1] 9497.0
r_12_4 Vin[12] Vout_+[2] 15000.0
r_12_5 Vin[12] Vout_-[2] 10558.0
r_12_6 Vin[12] Vout_+[3] 15000.0
r_12_7 Vin[12] Vout_-[3] 13328.0
r_12_8 Vin[12] Vout_+[4] 9179.0
r_12_9 Vin[12] Vout_-[4] 15000.0
r_13_0 Vin[13] Vout_+[0] 15000.0
r_13_1 Vin[13] Vout_-[0] 12246.0
r_13_2 Vin[13] Vout_+[1] 15000.0
r_13_3 Vin[13] Vout_-[1] 9618.0
r_13_4 Vin[13] Vout_+[2] 15000.0
r_13_5 Vin[13] Vout_-[2] 10156.0
r_13_6 Vin[13] Vout_+[3] 13792.0
r_13_7 Vin[13] Vout_-[3] 15000.0
r_13_8 Vin[13] Vout_+[4] 9408.0
r_13_9 Vin[13] Vout_-[4] 15000.0
r_14_0 Vin[14] Vout_+[0] 15000.0
r_14_1 Vin[14] Vout_-[0] 11312.0
r_14_2 Vin[14] Vout_+[1] 15000.0
r_14_3 Vin[14] Vout_-[1] 9797.0
r_14_4 Vin[14] Vout_+[2] 15000.0
r_14_5 Vin[14] Vout_-[2] 10194.0
r_14_6 Vin[14] Vout_+[3] 13478.0
r_14_7 Vin[14] Vout_-[3] 15000.0
r_14_8 Vin[14] Vout_+[4] 7813.0
r_14_9 Vin[14] Vout_-[4] 15000.0
r_15_0 Vin[15] Vout_+[0] 15000.0
r_15_1 Vin[15] Vout_-[0] 12751.0
r_15_2 Vin[15] Vout_+[1] 15000.0
r_15_3 Vin[15] Vout_-[1] 9665.0
r_15_4 Vin[15] Vout_+[2] 15000.0
r_15_5 Vin[15] Vout_-[2] 10311.0
r_15_6 Vin[15] Vout_+[3] 15000.0
r_15_7 Vin[15] Vout_-[3] 12571.0
r_15_8 Vin[15] Vout_+[4] 8879.0
r_15_9 Vin[15] Vout_-[4] 15000.0
r_16_0 Vin[16] Vout_+[0] 15000.0
r_16_1 Vin[16] Vout_-[0] 11724.0
r_16_2 Vin[16] Vout_+[1] 15000.0
r_16_3 Vin[16] Vout_-[1] 9408.0
r_16_4 Vin[16] Vout_+[2] 15000.0
r_16_5 Vin[16] Vout_-[2] 10608.0
r_16_6 Vin[16] Vout_+[3] 15000.0
r_16_7 Vin[16] Vout_-[3] 13070.0
r_16_8 Vin[16] Vout_+[4] 8994.0
r_16_9 Vin[16] Vout_-[4] 15000.0
r_17_0 Vin[17] Vout_+[0] 15000.0
r_17_1 Vin[17] Vout_-[0] 11368.0
r_17_2 Vin[17] Vout_+[1] 15000.0
r_17_3 Vin[17] Vout_-[1] 9533.0
r_17_4 Vin[17] Vout_+[2] 15000.0
r_17_5 Vin[17] Vout_-[2] 10280.0
r_17_6 Vin[17] Vout_+[3] 13140.0
r_17_7 Vin[17] Vout_-[3] 15000.0
r_17_8 Vin[17] Vout_+[4] 9153.0
r_17_9 Vin[17] Vout_-[4] 15000.0
r_18_0 Vin[18] Vout_+[0] 15000.0
r_18_1 Vin[18] Vout_-[0] 12228.0
r_18_2 Vin[18] Vout_+[1] 15000.0
r_18_3 Vin[18] Vout_-[1] 9452.0
r_18_4 Vin[18] Vout_+[2] 15000.0
r_18_5 Vin[18] Vout_-[2] 10236.0
r_18_6 Vin[18] Vout_+[3] 15000.0
r_18_7 Vin[18] Vout_-[3] 13434.0
r_18_8 Vin[18] Vout_+[4] 8261.0
r_18_9 Vin[18] Vout_-[4] 15000.0
r_19_0 Vin[19] Vout_+[0] 15000.0
r_19_1 Vin[19] Vout_-[0] 12546.0
r_19_2 Vin[19] Vout_+[1] 15000.0
r_19_3 Vin[19] Vout_-[1] 9352.0
r_19_4 Vin[19] Vout_+[2] 15000.0
r_19_5 Vin[19] Vout_-[2] 10059.0
r_19_6 Vin[19] Vout_+[3] 15000.0
r_19_7 Vin[19] Vout_-[3] 13561.0
r_19_8 Vin[19] Vout_+[4] 10987.0
r_19_9 Vin[19] Vout_-[4] 15000.0
r_20_0 Vin[20] Vout_+[0] 15000.0
r_20_1 Vin[20] Vout_-[0] 11168.0
r_20_2 Vin[20] Vout_+[1] 15000.0
r_20_3 Vin[20] Vout_-[1] 9297.0
r_20_4 Vin[20] Vout_+[2] 15000.0
r_20_5 Vin[20] Vout_-[2] 9911.0
r_20_6 Vin[20] Vout_+[3] 15000.0
r_20_7 Vin[20] Vout_-[3] 11906.0
r_20_8 Vin[20] Vout_+[4] 9553.0
r_20_9 Vin[20] Vout_-[4] 15000.0
r_21_0 Vin[21] Vout_+[0] 15000.0
r_21_1 Vin[21] Vout_-[0] 11641.0
r_21_2 Vin[21] Vout_+[1] 15000.0
r_21_3 Vin[21] Vout_-[1] 9434.0
r_21_4 Vin[21] Vout_+[2] 15000.0
r_21_5 Vin[21] Vout_-[2] 9952.0
r_21_6 Vin[21] Vout_+[3] 15000.0
r_21_7 Vin[21] Vout_-[3] 12878.0
r_21_8 Vin[21] Vout_+[4] 9865.0
r_21_9 Vin[21] Vout_-[4] 15000.0
r_22_0 Vin[22] Vout_+[0] 15000.0
r_22_1 Vin[22] Vout_-[0] 12108.0
r_22_2 Vin[22] Vout_+[1] 15000.0
r_22_3 Vin[22] Vout_-[1] 9238.0
r_22_4 Vin[22] Vout_+[2] 15000.0
r_22_5 Vin[22] Vout_-[2] 10227.0
r_22_6 Vin[22] Vout_+[3] 15000.0
r_22_7 Vin[22] Vout_-[3] 14969.0
r_22_8 Vin[22] Vout_+[4] 9094.0
r_22_9 Vin[22] Vout_-[4] 15000.0
r_23_0 Vin[23] Vout_+[0] 15000.0
r_23_1 Vin[23] Vout_-[0] 11903.0
r_23_2 Vin[23] Vout_+[1] 15000.0
r_23_3 Vin[23] Vout_-[1] 9216.0
r_23_4 Vin[23] Vout_+[2] 15000.0
r_23_5 Vin[23] Vout_-[2] 10168.0
r_23_6 Vin[23] Vout_+[3] 15000.0
r_23_7 Vin[23] Vout_-[3] 14183.0
r_23_8 Vin[23] Vout_+[4] 9469.0
r_23_9 Vin[23] Vout_-[4] 15000.0
r_24_0 Vin[24] Vout_+[0] 15000.0
r_24_1 Vin[24] Vout_-[0] 12139.0
r_24_2 Vin[24] Vout_+[1] 15000.0
r_24_3 Vin[24] Vout_-[1] 8930.0
r_24_4 Vin[24] Vout_+[2] 15000.0
r_24_5 Vin[24] Vout_-[2] 9709.0
r_24_6 Vin[24] Vout_+[3] 15000.0
r_24_7 Vin[24] Vout_-[3] 12559.0
r_24_8 Vin[24] Vout_+[4] 13827.0
r_24_9 Vin[24] Vout_-[4] 15000.0
r_25_0 Vin[25] Vout_+[0] 8508.0
r_25_1 Vin[25] Vout_-[0] 15000.0
r_25_2 Vin[25] Vout_+[1] 5497.0
r_25_3 Vin[25] Vout_-[1] 15000.0
r_25_4 Vin[25] Vout_+[2] 6245.0
r_25_5 Vin[25] Vout_-[2] 15000.0
r_25_6 Vin[25] Vout_+[3] 15000.0
r_25_7 Vin[25] Vout_-[3] 11427.0
r_25_8 Vin[25] Vout_+[4] 15000.0
r_25_9 Vin[25] Vout_-[4] 11053.0
.backanno
.end